# Altium schematic sheet Arduino.SchDoc
size A; SheetNumber: 2; SheetTotal: 2
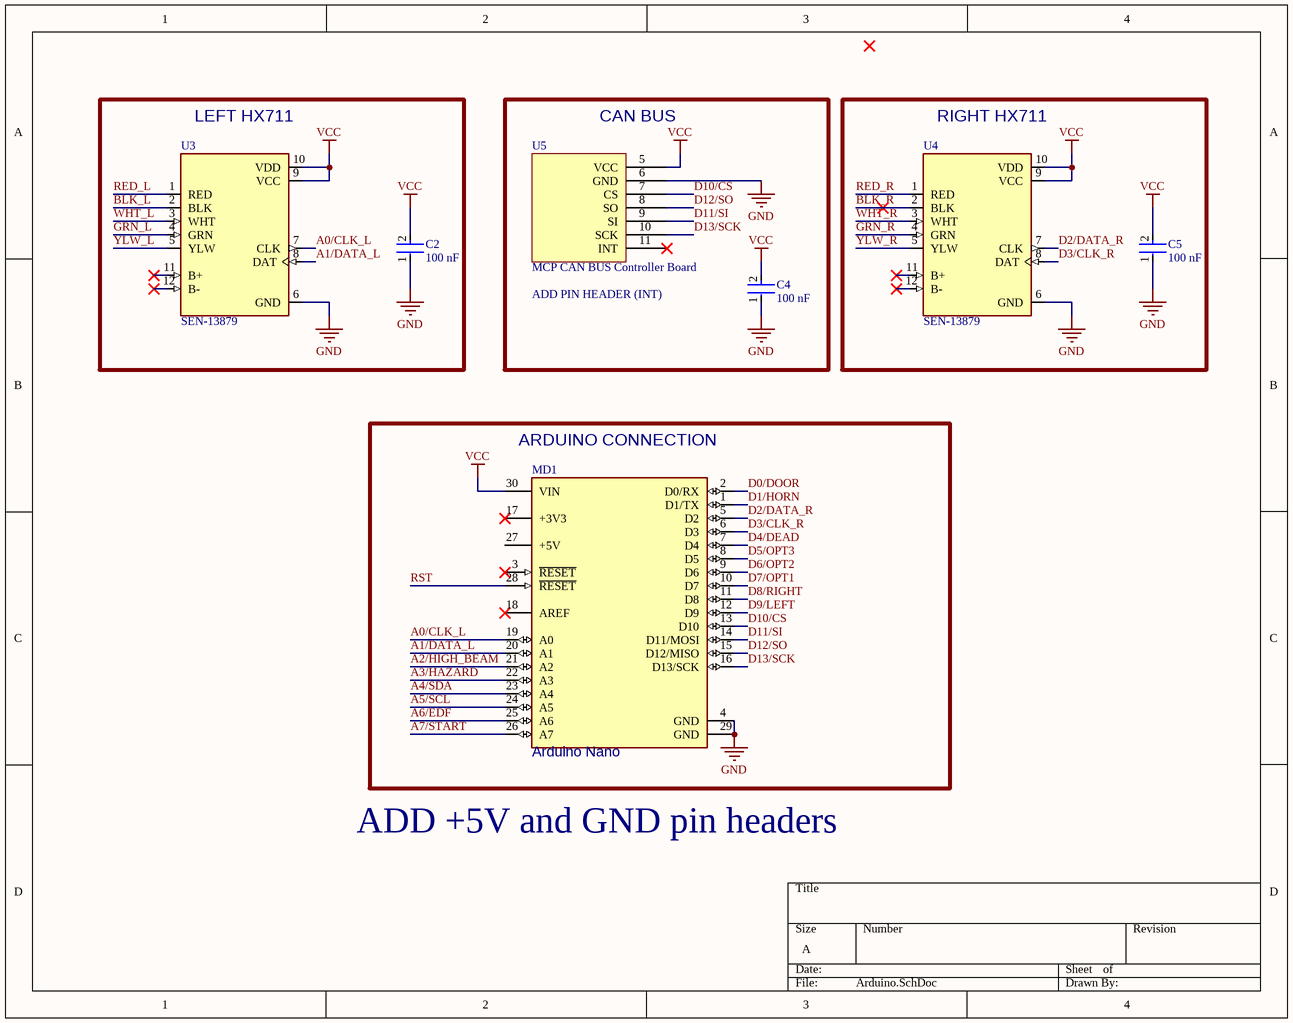
[diagram p0: Arduino.SchDoc]

## Parts
C2  100 nF  [FP-562R5GAS10-MFG]
C4  100 nF  [FP-562R5GAS10-MFG]
C5  100 nF  [FP-562R5GAS10-MFG]
MD1  Arduino Nano  [FP-A000005-MFG]
U3  SEN-13879  [SPARKFUN_SEN-13879]
U4  SEN-13879  [SPARKFUN_SEN-13879]
U5  MCP CAN BUS Controller Board  [MCP2515]

## Blocks framed on the sheet
LEFT HX711: C2 U3
CAN BUS: C4 U5
RIGHT HX711: C5 U4
ARDUINO CONNECTION: MD1

## Nets
GND: C2.1 C4.1 C5.1 MD1.4(GND) MD1.29(GND) U3.6(GND) U4.6(GND) U5.6(GND)
VCC: C2.2 C4.2 C5.2 MD1.30(VIN) U3.9(VCC) U3.10(VDD) U4.9(VCC) U4.10(VDD) U5.5(VCC)
A0/CLK_L: MD1.19(A0) U3.7(CLK)
A1/DATA_L: MD1.20(A1) U3.8(DAT)
A2/HIGH_BEAM: MD1.21(A2)
A3/HAZARD: MD1.22(A3)
A4/SDA: MD1.23(A4)
A5/SCL: MD1.24(A5)
A6/EDF: MD1.25(A6)
A7/START: MD1.26(A7)
BLK_L: U3.2(BLK)
BLK_R: U4.2(BLK)
D0/DOOR: MD1.2(D0/RX)
D1/HORN: MD1.1(D1/TX)
D2/DATA_R: MD1.5(D2) U4.7(CLK)
D3/CLK_R: MD1.6(D3) U4.8(DAT)
D4/DEAD: MD1.7(D4)
D5/OPT3: MD1.8(D5)
D6/OPT2: MD1.9(D6)
D7/OPT1: MD1.10(D7)
D8/RIGHT: MD1.11(D8)
D9/LEFT: MD1.12(D9)
D10/CS: MD1.13(D10) U5.7(CS)
D11/SI: MD1.14(D11/MOSI) U5.9(SI)
D12/SO: MD1.15(D12/MISO) U5.8(SO)
D13/SCK: MD1.16(D13/SCK) U5.10(SCK)
GRN_L: U3.4(GRN)
GRN_R: U4.4(GRN)
RED_L: U3.1(RED)
RED_R: U4.1(RED)
RST: MD1.28(~{RESET})
WHT_L: U3.3(WHT)
WHT_R: U4.3(WHT)
YLW_L: U3.5(YLW)
YLW_R: U4.5(YLW)

Not connected (* = marked no-connect by the designer): MD1 3(~{RESET})* 17(+3V3)* 18(AREF)* 27(+5V); U3 11(B+)* 12(B-)*; U4 11(B+)* 12(B-)*; U5 11(INT)*

## Notes on the sheet
- (near U5) ADD PIN HEADER (INT)
- ADD +5V and GND pin headers

## Library data of the parts
C2 C4 C5 = CMP-02417-000061-1: CAP CER 10000PF 1KV Z5U RADIAL; Dissipation Factor: 2.5%; Tolerance: 20%; Lead Length: 29mm; Lead Diameter: 0.64mm; Lead/Base Style: Straight; Application(s): GENERAL PURPOSE; Capacitance: 10nF; Voltage Rating: 1kV; Voltage Rating (DC): 1kV; Depth: 4mm; Package Quantity: 250; Case/Package: Radial; Radiation Hardening: No; Diameter: 12.4mm; Dielectric: Z5U; Series: Cera-Mite 562R; Height: 0.25inch; Length: 2inch; Resistor Type: Ceramic; Width: 4mm; Contact Plating: Tin; Height - Seated (Max): 0.613inch; Packaging: Bulk; Lead Free: Lead Free; Construction: RADIAL; Mount: Through Hole; RoHS Compliant: Yes; Termination: Radial; Min Operating Temperature: -55°C; Lead Pitch: 9.5mm; Weight: 0.01lb; Max Operating Temperature: 105°C; Voltage: 1kV
MD1 = CMP-189986-000002-1: ARDUINO NANO ATMEGA328 EVAL BRD; Number of Bits: 8; Evaluation Kit: Yes; Operating Supply Voltage: 12V; Interface: I2C; Data Bus Width: 8b; Core Architecture: AVR; Packaging: Bulk; Length: 7inch; Package Quantity: 50; Width: 5inch; REACH SVHC: No SVHC; Weight: 0.358383oz; Series: AVR® ATmega; Height: 0.25inch
U3 U4 = SEN-13879: Load Cell Amp Hx711; Package: None; MP: SEN-13879; Price: None; Availability: Unavailable; Value: *
U5 = MCP2515 Module